# Altium project isg_eos_control_board_xem3001.PrjPcb (part 2 of 2)
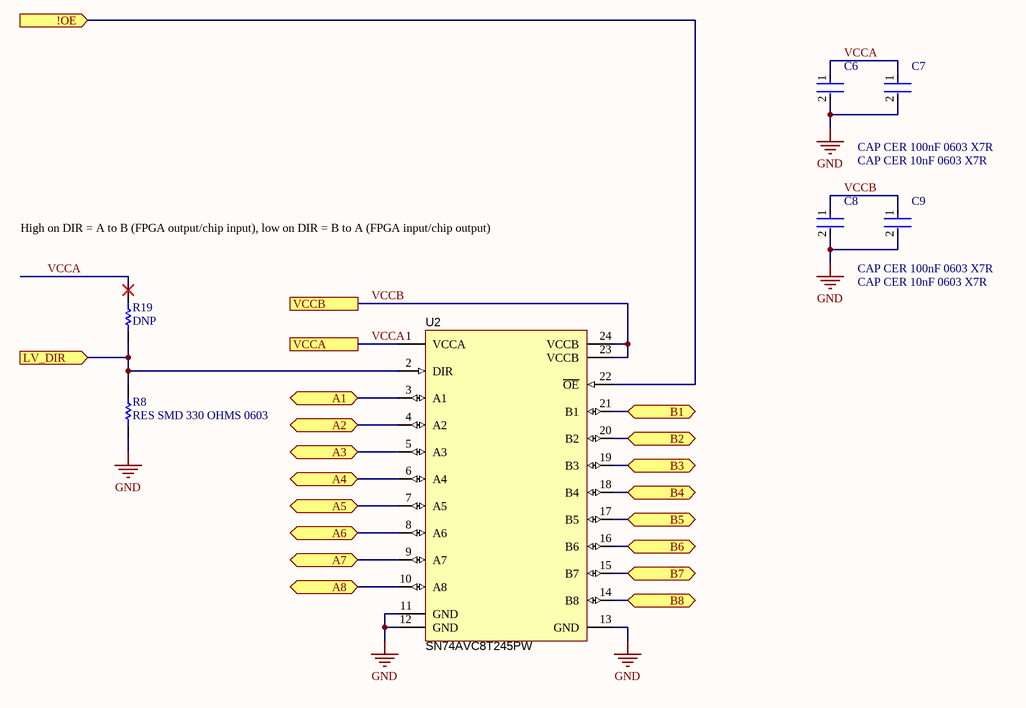
[diagram p8: subckt_level_shifter.SchDoc]

## Nets that join several sheets
GND: isg_eos_control_board_xem3001 (133 pins), subckt_adjustable_LDO (10 pins), LS0 (8 pins), LS1 (8 pins), LS2 (8 pins), LS3 (8 pins), LS4 (8 pins), LS5 (8 pins), LS6 (8 pins), LS7 (8 pins)
PP_P1V8_IO_DVDD: isg_eos_control_board_xem3001 (Q1.1), subckt_adjustable_LDO (7 pins), LS0 (C8_LS0.1 C9_LS0.1 U2_LS0.23 U2_LS0.24), LS1 (C8_LS1.1 C9_LS1.1 U2_LS1.23 U2_LS1.24), LS2 (C8_LS2.1 C9_LS2.1 U2_LS2.23 U2_LS2.24), LS3 (C8_LS3.1 C9_LS3.1 U2_LS3.23 U2_LS3.24), LS4 (C8_LS4.1 C9_LS4.1 U2_LS4.23 U2_LS4.24), LS5 (C8_LS5.1 C9_LS5.1 U2_LS5.23 U2_LS5.24), LS6 (C8_LS6.1 C9_LS6.1 U2_LS6.23 U2_LS6.24), LS7 (C8_LS7.1 C9_LS7.1 U2_LS7.23 U2_LS7.24)
PP_P3V3_IO_FPGA: isg_eos_control_board_xem3001 (15 pins), subckt_adjustable_LDO (C1.1 R2.2 U1.7 U1.8), LS0 (C6_LS0.1 C7_LS0.1 R19_LS0.1 U2_LS0.1), LS1 (C6_LS1.1 C7_LS1.1 R19_LS1.1 U2_LS1.1), LS2 (C6_LS2.1 C7_LS2.1 R19_LS2.1 U2_LS2.1), LS3 (C6_LS3.1 C7_LS3.1 R19_LS3.1 U2_LS3.1), LS4 (C6_LS4.1 C7_LS4.1 R19_LS4.1 U2_LS4.1), LS5 (C6_LS5.1 C7_LS5.1 R19_LS5.1 U2_LS5.1), LS6 (C6_LS6.1 C7_LS6.1 R19_LS6.1 U2_LS6.1), LS7 (C6_LS7.1 C7_LS7.1 R19_LS7.1 U2_LS7.1)
!OE: isg_eos_control_board_xem3001 (P4.2 R7.2 R18.1), LS0 (U2_LS0.22), LS1 (U2_LS1.22), LS2 (U2_LS2.22), LS3 (U2_LS3.22), LS4 (U2_LS4.22), LS5 (U2_LS5.22), LS6 (U2_LS6.22), LS7 (U2_LS7.22)
CHIP_IO_0: isg_eos_control_board_xem3001 (J6.16 JP2.1), LS0 (U2_LS0.21)
CHIP_IO_1: isg_eos_control_board_xem3001 (J6.14 JP2.2), LS0 (U2_LS0.20)
CHIP_IO_2: isg_eos_control_board_xem3001 (J6.12 JP2.3), LS0 (U2_LS0.19)
CHIP_IO_3: isg_eos_control_board_xem3001 (J6.10 JP2.4), LS0 (U2_LS0.18)
CHIP_IO_4: isg_eos_control_board_xem3001 (J6.8 JP2.5), LS0 (U2_LS0.17)
CHIP_IO_5: isg_eos_control_board_xem3001 (J6.6 JP2.6), LS0 (U2_LS0.16)
CHIP_IO_6: isg_eos_control_board_xem3001 (J6.4 JP2.7), LS0 (U2_LS0.15)
CHIP_IO_7: isg_eos_control_board_xem3001 (J6.2 JP2.8), LS0 (U2_LS0.14)
CHIP_IO_8: isg_eos_control_board_xem3001 (J7.16 JP2.9), LS1 (U2_LS1.21)
CHIP_IO_9: isg_eos_control_board_xem3001 (J7.14 JP2.10), LS1 (U2_LS1.20)
CHIP_IO_10: isg_eos_control_board_xem3001 (J7.12 JP2.11), LS1 (U2_LS1.19)
CHIP_IO_11: isg_eos_control_board_xem3001 (J7.10 JP2.12), LS1 (U2_LS1.18)
CHIP_IO_12: isg_eos_control_board_xem3001 (J7.8 JP2.13), LS1 (U2_LS1.17)
CHIP_IO_13: isg_eos_control_board_xem3001 (J7.6 JP2.14), LS1 (U2_LS1.16)
CHIP_IO_14: isg_eos_control_board_xem3001 (J7.4 JP2.15), LS1 (U2_LS1.15)
CHIP_IO_15: isg_eos_control_board_xem3001 (J7.2 JP2.16), LS1 (U2_LS1.14)
CHIP_IO_16: isg_eos_control_board_xem3001 (J8.16 JP4.1), LS2 (U2_LS2.21)
CHIP_IO_17: isg_eos_control_board_xem3001 (J8.14 JP4.2), LS2 (U2_LS2.20)
CHIP_IO_18: isg_eos_control_board_xem3001 (J8.12 JP4.3), LS2 (U2_LS2.19)
CHIP_IO_19: isg_eos_control_board_xem3001 (J8.10 JP4.4), LS2 (U2_LS2.18)
CHIP_IO_20: isg_eos_control_board_xem3001 (J8.8 JP4.5), LS2 (U2_LS2.17)
CHIP_IO_21: isg_eos_control_board_xem3001 (J8.6 JP4.6), LS2 (U2_LS2.16)
CHIP_IO_22: isg_eos_control_board_xem3001 (J8.4 JP4.7), LS2 (U2_LS2.15)
CHIP_IO_23: isg_eos_control_board_xem3001 (J8.2 JP4.8), LS2 (U2_LS2.14)
CHIP_IO_24: isg_eos_control_board_xem3001 (J9.16 JP4.9), LS3 (U2_LS3.21)
CHIP_IO_25: isg_eos_control_board_xem3001 (J9.14 JP4.10), LS3 (U2_LS3.20)
CHIP_IO_26: isg_eos_control_board_xem3001 (J9.12 JP4.11), LS3 (U2_LS3.19)
CHIP_IO_27: isg_eos_control_board_xem3001 (J9.10 JP4.12), LS3 (U2_LS3.18)
CHIP_IO_28: isg_eos_control_board_xem3001 (J9.8 JP4.13), LS3 (U2_LS3.17)
CHIP_IO_29: isg_eos_control_board_xem3001 (J9.6 JP4.14), LS3 (U2_LS3.16)
CHIP_IO_30: isg_eos_control_board_xem3001 (J9.4 JP4.15), LS3 (U2_LS3.15)
CHIP_IO_31: isg_eos_control_board_xem3001 (J9.2 JP4.16), LS3 (U2_LS3.14)
CHIP_IO_32: isg_eos_control_board_xem3001 (J10.16 JP6.1), LS4 (U2_LS4.21)
CHIP_IO_33: isg_eos_control_board_xem3001 (J10.14 JP6.2), LS4 (U2_LS4.20)
CHIP_IO_34: isg_eos_control_board_xem3001 (J10.12 JP6.3), LS4 (U2_LS4.19)
CHIP_IO_35: isg_eos_control_board_xem3001 (J10.10 JP6.4), LS4 (U2_LS4.18)
CHIP_IO_36: isg_eos_control_board_xem3001 (J10.8 JP6.5), LS4 (U2_LS4.17)
CHIP_IO_37: isg_eos_control_board_xem3001 (J10.6 JP6.6), LS4 (U2_LS4.16)
CHIP_IO_38: isg_eos_control_board_xem3001 (J10.4 JP6.7), LS4 (U2_LS4.15)
CHIP_IO_39: isg_eos_control_board_xem3001 (J10.2 JP6.8), LS4 (U2_LS4.14)
CHIP_IO_40: isg_eos_control_board_xem3001 (J11.16 JP6.9), LS5 (U2_LS5.21)
CHIP_IO_41: isg_eos_control_board_xem3001 (J11.14 JP6.10), LS5 (U2_LS5.20)
CHIP_IO_42: isg_eos_control_board_xem3001 (J11.12 JP6.11), LS5 (U2_LS5.19)
CHIP_IO_43: isg_eos_control_board_xem3001 (J11.10 JP6.12), LS5 (U2_LS5.18)
CHIP_IO_44: isg_eos_control_board_xem3001 (J11.8 JP6.13), LS5 (U2_LS5.17)
CHIP_IO_45: isg_eos_control_board_xem3001 (J11.6 JP6.14), LS5 (U2_LS5.16)
CHIP_IO_46: isg_eos_control_board_xem3001 (J11.4 JP6.15), LS5 (U2_LS5.15)
CHIP_IO_47: isg_eos_control_board_xem3001 (J11.2 JP6.16), LS5 (U2_LS5.14)
CHIP_IO_48: isg_eos_control_board_xem3001 (J12.16 JP8.1), LS6 (U2_LS6.21)
CHIP_IO_49: isg_eos_control_board_xem3001 (J12.14 JP8.2), LS6 (U2_LS6.20)
CHIP_IO_50: isg_eos_control_board_xem3001 (J12.12 JP8.3), LS6 (U2_LS6.19)
CHIP_IO_51: isg_eos_control_board_xem3001 (J12.10 JP8.4), LS6 (U2_LS6.18)
CHIP_IO_52: isg_eos_control_board_xem3001 (J12.8 JP8.5), LS6 (U2_LS6.17)
CHIP_IO_53: isg_eos_control_board_xem3001 (J12.6 JP8.6), LS6 (U2_LS6.16)
CHIP_IO_54: isg_eos_control_board_xem3001 (J12.4 JP8.7), LS6 (U2_LS6.15)
CHIP_IO_55: isg_eos_control_board_xem3001 (J12.2 JP8.8), LS6 (U2_LS6.14)
CHIP_IO_56: isg_eos_control_board_xem3001 (J13.16 JP8.9), LS7 (U2_LS7.21)
CHIP_IO_57: isg_eos_control_board_xem3001 (J13.14 JP8.10), LS7 (U2_LS7.20)
CHIP_IO_58: isg_eos_control_board_xem3001 (J13.12 JP8.11), LS7 (U2_LS7.19)
CHIP_IO_59: isg_eos_control_board_xem3001 (J13.10 JP8.12), LS7 (U2_LS7.18)
CHIP_IO_60: isg_eos_control_board_xem3001 (J13.8 JP8.13), LS7 (U2_LS7.17)
CHIP_IO_61: isg_eos_control_board_xem3001 (J13.6 JP8.14), LS7 (U2_LS7.16)
CHIP_IO_62: isg_eos_control_board_xem3001 (J13.4 JP8.15), LS7 (U2_LS7.15)
CHIP_IO_63: isg_eos_control_board_xem3001 (J13.2 JP8.16), LS7 (U2_LS7.14)
FPGA_IO_0: isg_eos_control_board_xem3001 (JP1.1 M1.Y15), LS0 (U2_LS0.3)
FPGA_IO_1: isg_eos_control_board_xem3001 (JP1.2 M1.Y16), LS0 (U2_LS0.4)
FPGA_IO_2: isg_eos_control_board_xem3001 (JP1.3 M1.Y17), LS0 (U2_LS0.5)
FPGA_IO_3: isg_eos_control_board_xem3001 (JP1.4 M1.Y18), LS0 (U2_LS0.6)
FPGA_IO_4: isg_eos_control_board_xem3001 (JP1.5 M1.Y21), LS0 (U2_LS0.7)
FPGA_IO_5: isg_eos_control_board_xem3001 (JP1.6 M1.Y22), LS0 (U2_LS0.8)
FPGA_IO_6: isg_eos_control_board_xem3001 (JP1.7 M1.Y23), LS0 (U2_LS0.9)
FPGA_IO_7: isg_eos_control_board_xem3001 (JP1.8 M1.Y24), LS0 (U2_LS0.10)
FPGA_IO_8: isg_eos_control_board_xem3001 (JP1.9 M1.Y25), LS1 (U2_LS1.3)
FPGA_IO_9: isg_eos_control_board_xem3001 (JP1.10 M1.Y26), LS1 (U2_LS1.4)
FPGA_IO_10: isg_eos_control_board_xem3001 (JP1.11 M1.Y27), LS1 (U2_LS1.5)
FPGA_IO_11: isg_eos_control_board_xem3001 (JP1.12 M1.Y28), LS1 (U2_LS1.6)
FPGA_IO_12: isg_eos_control_board_xem3001 (JP1.13 M1.Y29), LS1 (U2_LS1.7)
FPGA_IO_13: isg_eos_control_board_xem3001 (JP1.14 M1.Y30), LS1 (U2_LS1.8)
FPGA_IO_14: isg_eos_control_board_xem3001 (JP1.15 M1.Y33), LS1 (U2_LS1.9)
FPGA_IO_15: isg_eos_control_board_xem3001 (JP1.16 M1.Y34), LS1 (U2_LS1.10)
FPGA_IO_16: isg_eos_control_board_xem3001 (JP3.1 M1.Y35), LS2 (U2_LS2.3)
FPGA_IO_17: isg_eos_control_board_xem3001 (JP3.2 M1.Y36), LS2 (U2_LS2.4)
FPGA_IO_18: isg_eos_control_board_xem3001 (JP3.3 M1.Y37), LS2 (U2_LS2.5)
FPGA_IO_19: isg_eos_control_board_xem3001 (JP3.4 M1.Y38), LS2 (U2_LS2.6)
FPGA_IO_20: isg_eos_control_board_xem3001 (JP3.5 M1.Y39), LS2 (U2_LS2.7)
FPGA_IO_21: isg_eos_control_board_xem3001 (JP3.6 M1.Y40), LS2 (U2_LS2.8)
FPGA_IO_22: isg_eos_control_board_xem3001 (JP3.7 M1.Y43), LS2 (U2_LS2.9)
FPGA_IO_23: isg_eos_control_board_xem3001 (JP3.8 M1.Y44), LS2 (U2_LS2.10)
FPGA_IO_24: isg_eos_control_board_xem3001 (JP3.9 M1.Y45), LS3 (U2_LS3.3)
FPGA_IO_25: isg_eos_control_board_xem3001 (JP3.10 M1.Y46), LS3 (U2_LS3.4)
FPGA_IO_26: isg_eos_control_board_xem3001 (JP3.11 M1.Y47), LS3 (U2_LS3.5)
FPGA_IO_27: isg_eos_control_board_xem3001 (JP3.12 M1.Y48), LS3 (U2_LS3.6)
FPGA_IO_28: isg_eos_control_board_xem3001 (JP3.13 M1.X3), LS3 (U2_LS3.7)
FPGA_IO_29: isg_eos_control_board_xem3001 (JP3.14 M1.X4), LS3 (U2_LS3.8)
FPGA_IO_30: isg_eos_control_board_xem3001 (JP3.15 M1.X5), LS3 (U2_LS3.9)
FPGA_IO_31: isg_eos_control_board_xem3001 (JP3.16 M1.X6), LS3 (U2_LS3.10)
FPGA_IO_32: isg_eos_control_board_xem3001 (JP5.1 M1.X7), LS4 (U2_LS4.3)
FPGA_IO_33: isg_eos_control_board_xem3001 (JP5.2 M1.X8), LS4 (U2_LS4.4)
FPGA_IO_34: isg_eos_control_board_xem3001 (JP5.3 M1.X11), LS4 (U2_LS4.5)
FPGA_IO_35: isg_eos_control_board_xem3001 (JP5.4 M1.X12), LS4 (U2_LS4.6)
FPGA_IO_36: isg_eos_control_board_xem3001 (JP5.5 M1.X13), LS4 (U2_LS4.7)
FPGA_IO_37: isg_eos_control_board_xem3001 (JP5.6 M1.X14), LS4 (U2_LS4.8)
FPGA_IO_38: isg_eos_control_board_xem3001 (JP5.7 M1.X15), LS4 (U2_LS4.9)
FPGA_IO_39: isg_eos_control_board_xem3001 (JP5.8 M1.X16), LS4 (U2_LS4.10)
FPGA_IO_40: isg_eos_control_board_xem3001 (JP5.9 M1.X17), LS5 (U2_LS5.3)
FPGA_IO_41: isg_eos_control_board_xem3001 (JP5.10 M1.X18), LS5 (U2_LS5.4)
FPGA_IO_42: isg_eos_control_board_xem3001 (JP5.11 M1.X21), LS5 (U2_LS5.5)
FPGA_IO_43: isg_eos_control_board_xem3001 (JP5.12 M1.X22), LS5 (U2_LS5.6)
FPGA_IO_44: isg_eos_control_board_xem3001 (JP5.13 M1.X23), LS5 (U2_LS5.7)
FPGA_IO_45: isg_eos_control_board_xem3001 (JP5.14 M1.X24), LS5 (U2_LS5.8)
FPGA_IO_46: isg_eos_control_board_xem3001 (JP5.15 M1.X25), LS5 (U2_LS5.9)
FPGA_IO_47: isg_eos_control_board_xem3001 (JP5.16 M1.X26), LS5 (U2_LS5.10)
FPGA_IO_48: isg_eos_control_board_xem3001 (JP7.1 M1.X27), LS6 (U2_LS6.3)
FPGA_IO_49: isg_eos_control_board_xem3001 (JP7.2 M1.X28), LS6 (U2_LS6.4)
FPGA_IO_50: isg_eos_control_board_xem3001 (JP7.3 M1.X29), LS6 (U2_LS6.5)
FPGA_IO_51: isg_eos_control_board_xem3001 (JP7.4 M1.X30), LS6 (U2_LS6.6)
FPGA_IO_52: isg_eos_control_board_xem3001 (JP7.5 M1.X33), LS6 (U2_LS6.7)
FPGA_IO_53: isg_eos_control_board_xem3001 (JP7.6 M1.X34), LS6 (U2_LS6.8)
FPGA_IO_54: isg_eos_control_board_xem3001 (JP7.7 M1.X35), LS6 (U2_LS6.9)
FPGA_IO_55: isg_eos_control_board_xem3001 (JP7.8 M1.X36), LS6 (U2_LS6.10)
FPGA_IO_56: isg_eos_control_board_xem3001 (JP7.9 M1.X37), LS7 (U2_LS7.3)
FPGA_IO_57: isg_eos_control_board_xem3001 (JP7.10 M1.X38), LS7 (U2_LS7.4)
FPGA_IO_58: isg_eos_control_board_xem3001 (JP7.11 M1.X39), LS7 (U2_LS7.5)
FPGA_IO_59: isg_eos_control_board_xem3001 (JP7.12 M1.X40), LS7 (U2_LS7.6)
FPGA_IO_60: isg_eos_control_board_xem3001 (JP7.13 M1.X43), LS7 (U2_LS7.7)
FPGA_IO_61: isg_eos_control_board_xem3001 (JP7.14 M1.X44), LS7 (U2_LS7.8)
FPGA_IO_62: isg_eos_control_board_xem3001 (JP7.15 M1.X45), LS7 (U2_LS7.9)
FPGA_IO_63: isg_eos_control_board_xem3001 (JP7.16 M1.X46), LS7 (U2_LS7.10)
LV_DIR_0: isg_eos_control_board_xem3001 (M1.Y5), LS0 (R8_LS0.1 R19_LS0.2 U2_LS0.2)
LV_DIR_1: isg_eos_control_board_xem3001 (M1.Y6), LS1 (R8_LS1.1 R19_LS1.2 U2_LS1.2)
LV_DIR_2: isg_eos_control_board_xem3001 (M1.Y7), LS2 (R8_LS2.1 R19_LS2.2 U2_LS2.2)
LV_DIR_3: isg_eos_control_board_xem3001 (M1.Y8), LS3 (R8_LS3.1 R19_LS3.2 U2_LS3.2)
LV_DIR_4: isg_eos_control_board_xem3001 (M1.Y11), LS4 (R8_LS4.1 R19_LS4.2 U2_LS4.2)
LV_DIR_5: isg_eos_control_board_xem3001 (M1.Y12), LS5 (R8_LS5.1 R19_LS5.2 U2_LS5.2)
LV_DIR_6: isg_eos_control_board_xem3001 (M1.Y13), LS6 (R8_LS6.1 R19_LS6.2 U2_LS6.2)
LV_DIR_7: isg_eos_control_board_xem3001 (M1.Y14), LS7 (R8_LS7.1 R19_LS7.2 U2_LS7.2)